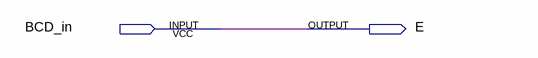
[diagram p0: schematic sheet]
// Quartus schematic DECOD_BCD_E.bdf as structural Verilog: 0 symbols, 2 pins
module DECOD_BCD_E (
  input  BCD_in,
  output E
);


  assign E = BCD_in;
endmodule
